# EAGLE design nutrino (EAGLE 9.6.2)
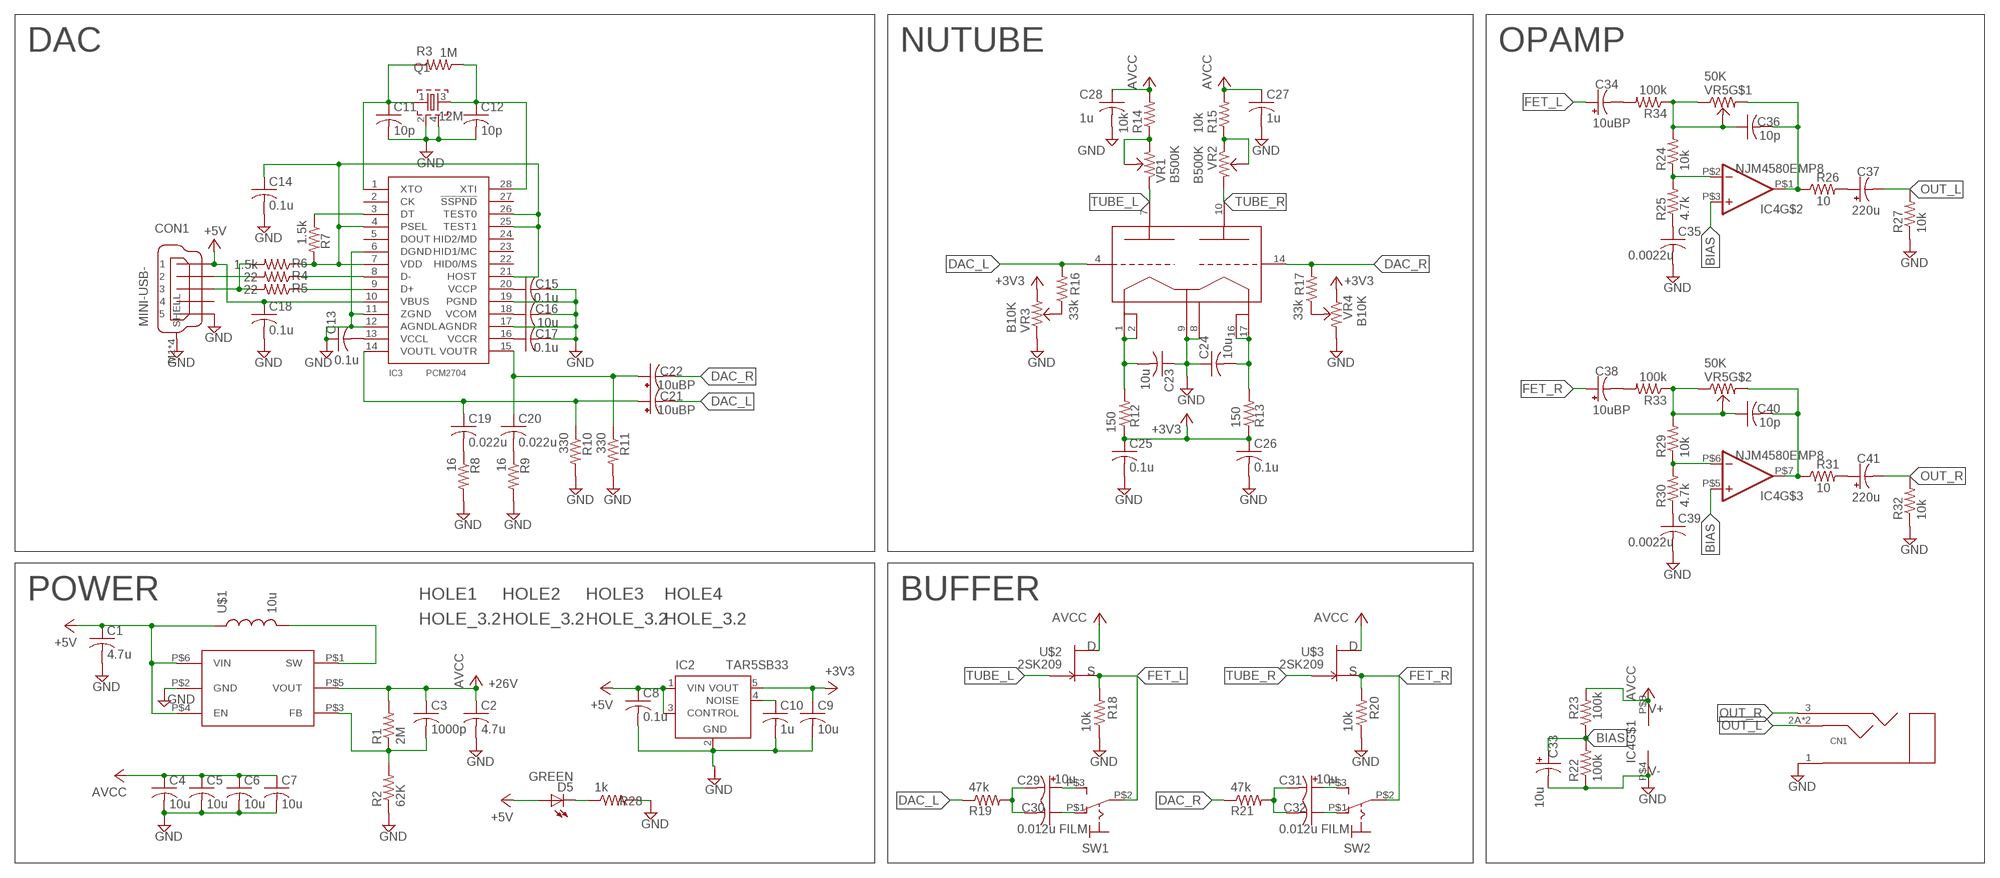
[diagram p0: schematic, sheet 1]

## Parts
C1  4.7u  C-2012  [2012-C]
C2  4.7u  C-2012  [2012-C]
C3  1000p  C-2012  [2012-C]
C4  10u  C-2012  [2012-C]
C5  10u  C-2012  [2012-C]
C6  10u  C-2012  [2012-C]
C7  10u  C-2012  [2012-C]
C8  0.1u  C-2012  [2012-C]
C9  10u  C-2012  [2012-C]
C10  1u  C-2012  [2012-C]
C11  10p  C-2012  [2012-C]
C12  10p  C-2012  [2012-C]
C13  0.1u  C-2012  [2012-C]
C14  0.1u  C-2012  [2012-C]
C15  0.1u  C-2012  [2012-C]
C16  10u  C-3216  [3216]
C17  0.1u  C-2012  [2012-C]
C18  0.1u  C-2012  [2012-C]
C19  0.022u  C-2012  [2012-C]
C20  0.022u  C-2012  [2012-C]
C21  10uBP  CC-2.5-7  [E2,5-7]
C22  10uBP  CC-2.5-7  [E2,5-7]
C23  10u  C-3216  [3216]
C24  10u  C-3216  [3216]
C25  0.1u  C-2012  [2012-C]
C26  0.1u  C-2012  [2012-C]
C27  1u  C-2012  [2012-C]
C28  1u  C-2012  [2012-C]
C29  10u  CC-2.5-7  [E2,5-7]
C30  0.012u FILM  C/5  [C050-024X044]
C31  10u  CC-2.5-7  [E2,5-7]
C32  0.012u FILM  C/5  [C050-024X044]
C33  10u  CC-2.5-7  [E2,5-7]
C34  10uBP  CC-2.5-7  [E2,5-7]
C35  0.0022u  C-2012  [2012-C]
C36  10p  C-2012  [2012-C]
C37  220u  CC-2.5-7  [E2,5-7]
C38  10uBP  CC-2.5-7  [E2,5-7]
C39  0.0022u  C-2012  [2012-C]
C40  10p  C-2012  [2012-C]
C41  220u  CC-2.5-7  [E2,5-7]
CN1  STEREO-3.5-MJ8435  [MJ8435]
CON1  MINI-USB-  [UX60A-MB-5ST]
D5  GREEN  LED-SMD2012  [D2012]
HOLE1  HOLE_3.2  [HOLE_3.2]
HOLE2  HOLE_3.2  [HOLE_3.2]
HOLE3  HOLE_3.2  [HOLE_3.2]
HOLE4  HOLE_3.2  [HOLE_3.2]
IC1  TLV61046A  [SOT23-6]
IC2  TAR5SB33  [SSOP5-P-0.95]
IC3  PCM2704  [SSOP28]
IC4  NJM4580EMP8  [EMP8]
Q1  12M  FA-238V  [FA-238V]
R1  2M  R-2012  [2012-R]
R2  62K  R-2012  [2012-R]
R3  1M  R-2012  [2012-R]
R4  22  R-2012  [2012-R]
R5  22  R-2012  [2012-R]
R6  1.5k  R-2012  [2012-R]
R7  1.5k  R-2012  [2012-R]
R8  16  R-2012  [2012-R]
R9  16  R-2012  [2012-R]
R10  330  R-2012  [2012-R]
R11  330  R-2012  [2012-R]
R12  150  R-2012  [2012-R]
R13  150  R-2012  [2012-R]
R14  10k  R-2012  [2012-R]
R15  10k  R-2012  [2012-R]
R16  33k  R-2012  [2012-R]
R17  33k  R-2012  [2012-R]
R18  10k  R-2012  [2012-R]
R19  47k  R-2012  [2012-R]
R20  10k  R-2012  [2012-R]
R21  47k  R-2012  [2012-R]
R22  100k  R-2012  [2012-R]
R23  100k  R-2012  [2012-R]
R24  10k  R-2012  [2012-R]
R25  4.7k  R-2012  [2012-R]
R26  10  R-4532  [4532]
R27  10k  R-2012  [2012-R]
R28  1k  R-2012  [2012-R]
R29  10k  R-2012  [2012-R]
R30  4.7k  R-2012  [2012-R]
R31  10  R-4532  [4532]
R32  10k  R-2012  [2012-R]
R33  100k  R-2012  [2012-R]
R34  100k  R-2012  [2012-R]
SW1  SLIDESW_SS12D01G4  [SS12D01G4]
SW2  SLIDESW_SS12D01G4  [SS12D01G4]
U1  NUTUBE_6P1_1  [NUTUBE_6P1_1]
U$1  10u  INDUCTOR-NR10050T  [NR10050T]
U$2  2SK209  [SC59]
U$3  2SK209  [SC59]
VR1  B500K  VR2  [VR2]
VR2  B500K  VR2  [VR2]
VR3  B10K  VR2  [VR2]
VR4  B10K  VR2  [VR2]
VR5  50K  VR2C  [VR2C]

## Nets
+3V3: C9.1 C25.1 C26.1 IC2.5(VOUT) R12.1 R13.1 VR3.2 VR4.1
+5V: C1.1 C8.1 C18.1 CON1.1 D5.A IC1.P$4(EN) IC1.P$6(VIN) IC2.1(VIN) IC2.3(CONTROL) IC3.10(VBUS) U$1.1
AVCC: C2.1 C3.1 C4.1 C5.1 C6.1 C7.1 C27.1 C28.1 IC1.P$5(VOUT) IC4.P$8(V+) R1.2 R14.2 R15.2 R23.2 U$2.E(D) U$3.E(D)
BIAS: C33.+ IC4.P$3(+IN) IC4.P$5(+IN) R22.2 R23.1
DAC_L: C21.- R16.2 R19.1 U1.4(G1_4)
DAC_R: C22.- R17.2 R21.1 U1.14(G2_14)
FET_L: C34.+ R18.2 SW1.P$2(P) U$2.B(S)
FET_R: C38.+ R20.2 SW2.P$2(P) U$3.B(S)
GND: C1.2 C2.2 C4.2 C5.2 C6.2 C7.2 C8.2 C9.2 C10.2 C11.2 C12.2 C13.1 C14.2 C15.2 C16.2 C17.2 C18.2 C23.1 C24.1 C25.2 C26.2 C27.2 C28.2 C33.- C35.2 C39.2 CN1.1(SLEEVE) CON1.5 CON1.M1(SHELL) CON1.M2(SHELL) CON1.M3(SHELL) CON1.M4(SHELL) IC1.P$2(GND) IC2.2(GND) IC3.6(DGND) IC3.11(ZGND) IC3.12(AGNDL) IC3.17(AGNDR) IC3.19(PGND) IC4.P$4(V-) Q1.2 Q1.4 R2.1 R8.2 R9.2 R10.2 R11.2 R18.1 R20.1 R22.1 R27.1 R28.2 R32.1 U1.8(GND_8) U1.9(F2_9) VR3.1 VR4.2
N$1: C11.1 IC3.1(XTO) Q1.1 R3.2
N$2: IC1.P$1(SW) U$1.2
N$3: C12.1 IC3.28(XTI) Q1.3 R3.1
N$4: C3.2 IC1.P$3(FB) R1.1 R2.2
N$5: IC3.9(D+) R5.1
N$6: IC3.8(D-) R4.1
N$7: CON1.2 R4.2
N$8: CON1.3 R5.2 R6.2
N$9: C13.2 IC3.13(VCCL)
N$10: C14.1 IC3.4(PSEL) IC3.7(VDD) IC3.21(HOST) IC3.25(TEST1) IC3.26(TEST0) R6.1 R7.2
N$11: C15.1 IC3.20(VCCP)
N$12: C17.1 IC3.16(VCCR)
N$13: C16.1 IC3.18(VCOM)
N$14: C19.2 R8.1
N$15: IC3.3(DT) R7.1
N$16: C20.2 R9.1
N$17: C20.1 C22.+ IC3.15(VOUTR) R11.1
N$18: C19.1 C21.+ IC3.14(VOUTL) R10.1
N$19: D5.K R28.1
N$20: R14.1 VR1.2 VR1.BR
N$21: C10.1 IC2.4(NOISE)
N$22: C24.2 R13.2 U1.16(F3_16) U1.17(F3_17)
N$23: C23.2 R12.2 U1.1(F1_1) U1.2(F1_2)
N$24: C30.1 SW1.P$1(O)
N$25: C29.+ SW1.P$3(S)
N$26: R15.1 VR2.1 VR2.BR
N$27: R16.1 VR3.BR
N$28: R17.1 VR4.BR
N$29: C32.1 SW2.P$1(O)
N$30: C31.+ SW2.P$3(S)
N$31: C29.- C30.2 R19.2
N$32: IC4.P$2(-IN) R24.1 R25.2
N$33: C35.1 R25.1
N$34: C36.1 R24.2 R34.1 VR5.2(BR) VR5.3
N$35: C34.- R34.2
N$36: C36.2 IC4.P$1(OUT) R26.1 VR5.1
N$37: C31.- C32.2 R21.2
N$38: C37.+ R26.2
N$40: IC4.P$6(-IN) R29.1 R30.2
N$41: C39.1 R30.1
N$42: C40.1 R29.2 R33.1 VR5.2'(BR) VR5.3'
N$43: C38.- R33.2
N$44: C40.2 IC4.P$7(OUT) R31.1 VR5.1'
N$45: C41.+ R31.2
OUT_L: C37.- CN1.2A(RING) CN1.2B(RING) R27.2
OUT_R: C41.- CN1.3(TIP) R32.2
TUBE_L: U1.7(A1_7) U$2.C(G) VR1.1
TUBE_R: U1.10(A2_10) U$3.C(G) VR2.2
Unconnected: CON1.4 IC3.2(CK) IC3.5(DOUT) IC3.22(HID0/MS) IC3.23(HID1/MC) IC3.24(HID2/MD) IC3.27(!SSPND!)

## Notes on the sheet
- DAC | NUTUBE | OPAMP
- POWER | BUFFER
- +26V

## Library data of the parts
C1-C20 C23-C28 C30 C32 C35 C36 C39 C40 = Passive_Robotech:C
C21 C22 C29 C31 C33 C34 C37 C38 C41 = Passive_Robotech:CC
CN1 = Connector_Robotech:STEREO
CON1 = Connector_Robotech:MINI-USB-: MINI USB Connector Source: http://www.hirose.co.jp/cataloge_hp/e24000019.pdf
D5 = Diode_Robotech:LED
HOLE1-HOLE4 = Document_Robotech:HOLE_3.2: Robotech hole diameter 3.2mm tDoc washer(diameter 8mm) bDoc spacer(diameter 6mm)
IC1 = IC_Robotech:TLV61046A
IC2 = IC_Robotech:TAR5SB: Voltage Regulator max 200mA. Pin assignment differs from TAR5S*
IC3 = IC_Robotech:PCM2704
IC4 = IC_Robotech:NJM4580
Q1 = Passive_Robotech:FA-: MHz RANGE CRYSTAL UNIT Source: Epson Toyocom
R1-R34 = Passive_Robotech:R
SW1 SW2 = Passive_Robotech:SLIDESW: Slide Switch
U1 = rezzonics:NUTUBE_6P1: NUTUBE 6P1 Twin Triode Datasheet <http://nutube.us/downloads/Nutube_Datasheet_31.pdf>
U$1 = Passive_Robotech:INDUCTOR: Inductors Basic Inductor/Choke - 0603 and 1206. Footprints are not proven and vary greatly between part numbers.
U$2 U$3 = Transistor_Robotech:2SK209
VR1-VR4 = Passive_Robotech:VR
VR5 = Passive_Robotech:VR2C

## Net classes
0 default: width 0.25 mm, drill 0.5 mm, clearance 0.254 mm
1 PWR: width 0.4 mm, drill 0.5 mm, clearance 0.254 mm

## Board
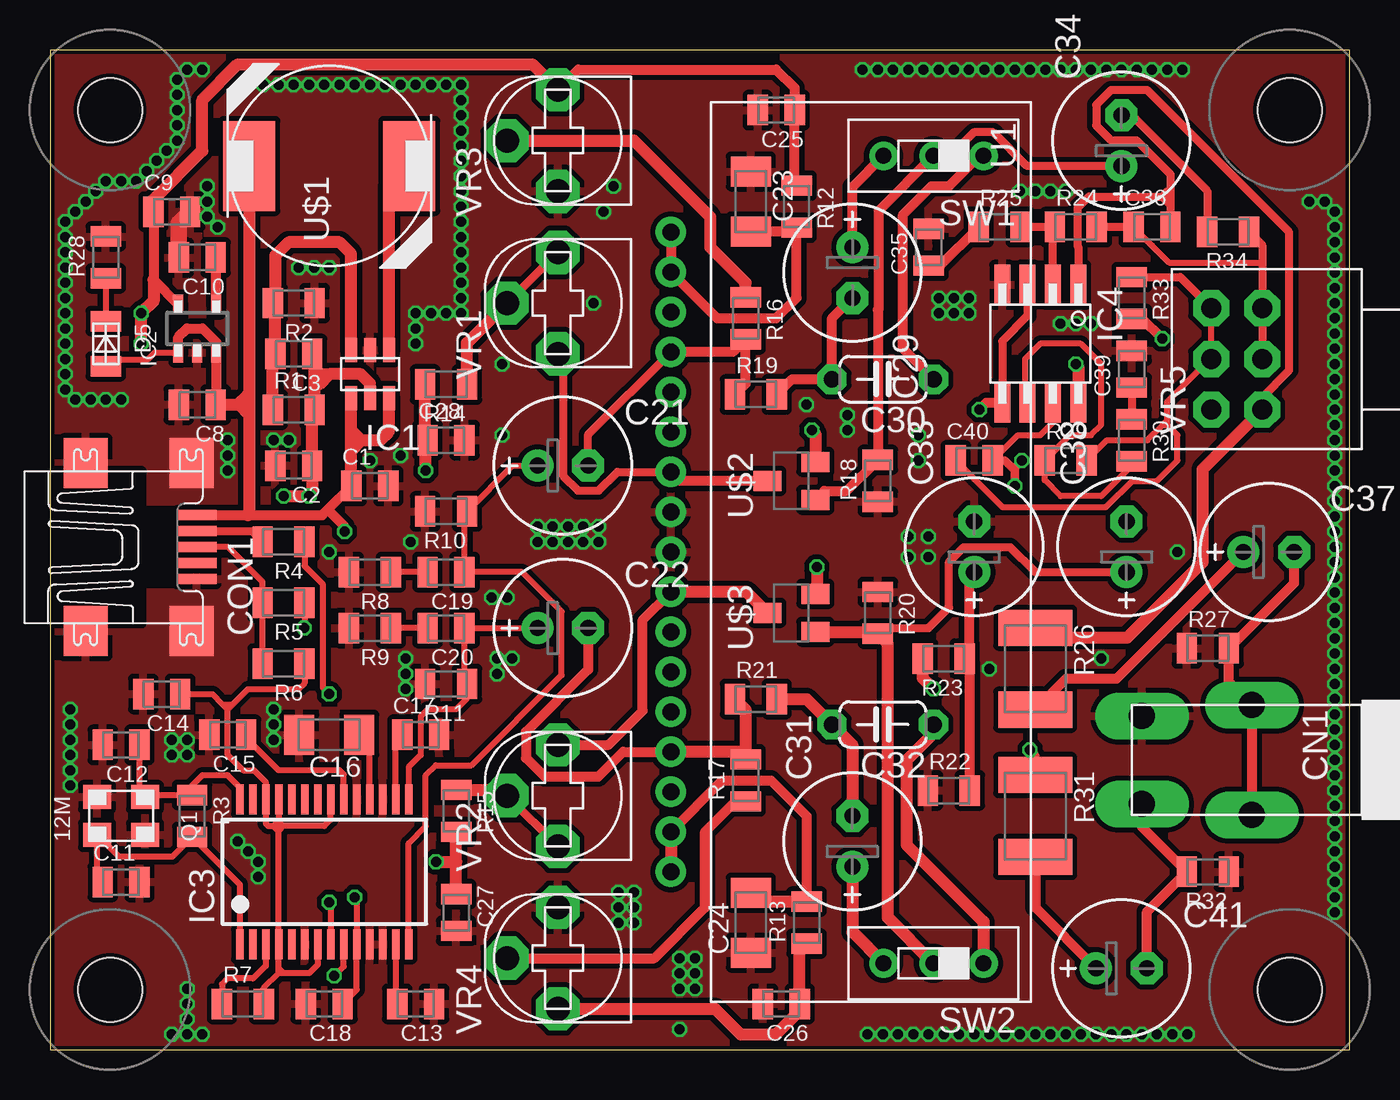
[diagram p1: board, top side]
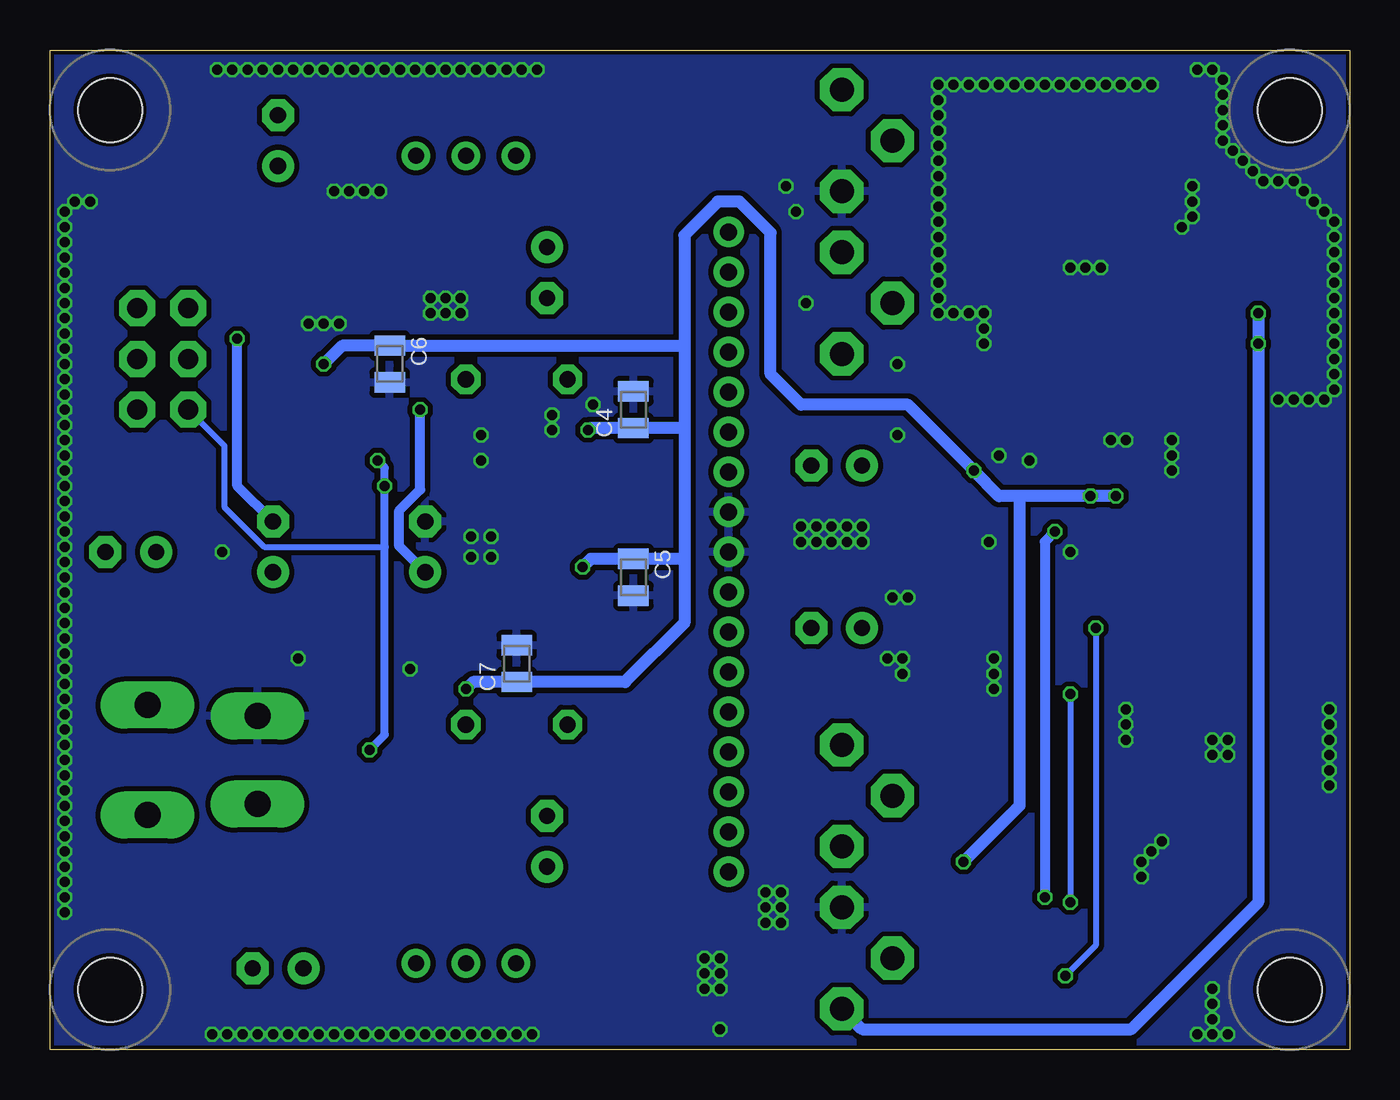
[diagram p2: board, bottom side, seen from below]

Size 65 x 50 mm. Coordinates in mm from the lower left corner, seen from the top.
Outline: 0,0 65,0 65,50 0,50 0,0
Copper layers (1*16): Top 0.035mm / dielectric 1.6mm / Bottom 0.035mm
Design rules "jlcpcb-2layers": minimum track width 5mil, minimum drill 0.3mm, track to track 5mil, track to pad 5mil, pad to pad 5mil, via to via 5mil, smd to smd 0mil, copper to edge 0.2mm, drill to drill 6mil, minimum pad ring 10mil, minimum via ring 3mil, stop-mask expansion 4mil, vias tented up to drill 0.5mm, thermal gap 10mil

### Footprints (pad centres in the part's own frame; a part is rotated, then mirrored left to right if it is on the bottom)
2012-C = smd 1.016 x 1.524: 1 -0.921,0; 2 0.921,0
3216 = smd 1.5 x 2: 1 -1.5,0; 2 1.5,0
E2,5-7 = drill 0.813 pad 1.6: + -1.27,0 | drill 0.813 pad 1.6 octagon: - 1.27,0
C050-024X044 = drill 0.813 octagon: 1 -2.54,0; 2 2.54,0
MJ8435 = drill 1.3 long: 1 -2.2,-5.5; 2A -2.75,0; 2B 2.75,0; 3 2.2,-5.5
UX60A-MB-5ST = smd 2 x 0.5: 1 2.25,1.6; 2 2.25,0.8; 3 2.25,0; 4 2.25,-0.8; 5 2.25,-1.6 | smd 2.2 x 2.5: M1 -3.3,-4.2; M2 -3.3,4.2; M3 2,4.2; M4 2,-4.2
D2012 = smd 1.016 x 1.524: A 1.127,0; K -1.127,0
HOLE_3.2 = hole 3.2: 0,0
SOT23-6 = smd 0.6 x 1.2: P$1 -0.95,-1.2; P$2 0,-1.2; P$3 0.95,-1.2; P$4 0.95,1.2; P$5 0,1.2; P$6 -0.95,1.2
SSOP5-P-0.95 = smd 0.5 x 1: 1 -0.95,-1.2; 2 0,-1.2; 3 0.95,-1.2; 4 0.95,1.2; 5 -0.95,1.2
SSOP28 = smd 0.38 x 1.5: 1 -4.225,-3.625; 2 -3.575,-3.625; 3 -2.925,-3.625; 4 -2.275,-3.625; 5 -1.625,-3.625; 6 -0.975,-3.625; 7 -0.325,-3.625; 8 0.325,-3.625; 9 0.975,-3.625; 10 1.625,-3.625; 11 2.275,-3.625; 12 2.925,-3.625; 13 3.575,-3.625; 14 4.225,-3.625; 15 4.225,3.625; 16 3.575,3.625; 17 2.925,3.625; 18 2.275,3.625; 19 1.625,3.625; 20 0.975,3.625; 21 0.325,3.625; 22 -0.325,3.625; 23 -0.975,3.625; 24 -1.625,3.625; 25 -2.275,3.625; 26 -2.925,3.625; 27 -3.575,3.625; 28 -4.225,3.625
EMP8 = smd 2 x 0.8: P$1 -2.95,1.905; P$2 -2.95,0.635; P$3 -2.95,-0.635; P$4 -2.95,-1.905; P$5 2.95,-1.905; P$6 2.95,-0.635; P$7 2.95,0.635; P$8 2.95,1.905
FA-238V = smd 1.4 x 1.2: 1 -1.2,-0.95; 2 1.2,-0.95; 3 1.2,0.95; 4 -1.2,0.95
2012-R = smd 1.016 x 1.524: 1 -1.048,0; 2 1.048,0
4532 = smd 1.8 x 3.7: 1 -2.05,0; 2 2.05,0
SS12D01G4 = drill 0.8 pad 1.27: P$1 -2.5,0; P$2 0,0; P$3 2.5,0
NUTUBE_6P1_1 = drill 0.85: 1 -16,-4; 2 -14,-4; 3 -12,-4; 4 -10,-4; 5 -8,-4; 6 -6,-4; 7 -4,-4; 8 -2,-4; 9 0,-4; 10 2,-4; 11 4,-4; 12 6,-4; 13 8,-4; 14 10,-4; 15 12,-4; 16 14,-4; 17 16,-4
NR10050T = smd 2.6 x 4.5: 1 -4,0; 2 4,0
SC59 = smd 1 x 1.4: B -0.95,-1.2; C 0,1.2; E 0.95,-1.2
VR2 = drill 1.2 octagon: 1 -2.54,0; 2 2.54,0; BR 0,2.54
VR2C = drill 1 octagon: 1 0,-2.54; 1' 0,0; 2 2.54,-2.54; 2' 2.54,0; 3 5.08,-2.54; 3' 5.08,0

### Placement (x,y rotation side)
C1  16,28.19 0 top
C2  12.19,29.21 180 top
C3  12.19,34.8 180 top
C4  35.81,32 90 bottom
C5  35.81,23.62 270 bottom
C6  48.01,34.29 270 bottom
C7  41.66,19.3 90 bottom
C8  7.37,32.26 180 top
C9  6.1,41.91 0 top
C10  7.37,39.62 180 top
C11  3.56,8.38 0 top
C12  3.56,15.24 180 top
C13  18.29,2.29 180 top
C14  5.59,17.78 180 top
C15  8.89,15.75 180 top
C16  13.97,15.75 180 top
C17  18.54,15.75 0 top
C18  13.72,2.29 180 top
C19  19.81,23.88 180 top
C20  19.81,21.08 180 top
C21  25.65,29.21 0 top
C22  25.65,21.08 0 top
C23  35.05,42.42 270 top
C24  35.05,6.35 90 top
C25  36.32,46.99 180 top
C26  36.58,2.29 180 top
C27  20.32,6.86 270 top
C28  19.81,30.48 0 top
C29  40.13,38.86 270 top
C30  41.66,33.53 180 top
C31  40.13,10.41 90 top
C32  41.66,16.26 180 top
C33  46.23,25.15 90 top
C34  53.59,45.47 90 top
C35  43.94,40.13 90 top
C36  55.12,41.15 0 top
C37  60.96,24.89 0 top
C38  53.85,25.15 90 top
C39  54.1,34.04 90 top
C40  46.23,29.46 0 top
C41  53.59,4.06 0 top
CN1  60.12,14.48 270 top
CON1  5.08,25.13 0 top
D5  2.79,35.31 270 top
HOLE1  3,47 0 top
HOLE2  3,3 0 top
HOLE3  62,3 0 top
HOLE4  62,47 0 top
IC1  16,33.78 180 top
IC2  7.37,36.07 0 top
IC3  13.72,8.89 0 top
IC4  49.53,35.31 270 top
Q1  3.56,11.68 0 top
R1  12.19,32 0 top
R2  12.19,37.34 180 top
R3  7.11,11.68 270 top
R4  11.68,25.4 180 top
R5  11.68,22.35 180 top
R6  11.68,19.3 180 top
R7  9.65,2.29 0 top
R8  16,23.88 180 top
R9  16,21.08 180 top
R10  19.81,26.92 180 top
R11  19.81,18.29 180 top
R12  37.34,42.16 270 top
R13  37.85,6.35 90 top
R14  19.81,33.27 180 top
R15  20.32,11.94 270 top
R16  34.8,36.58 270 top
R17  34.8,13.46 90 top
R18  41.4,28.45 90 top
R19  35.31,32.77 0 top
R20  41.4,21.84 270 top
R21  35.31,17.53 0 top
R22  44.96,12.95 0 top
R23  44.7,19.56 180 top
R24  51.31,41.15 0 top
R25  47.5,41.15 0 top
R26  49.28,19.05 270 top
R27  57.91,20.07 0 top
R28  2.79,39.62 90 top
R29  50.8,29.46 0 top
R30  54.1,30.48 270 top
R31  49.28,11.68 270 top
R32  57.91,8.89 180 top
R33  54.1,37.59 270 top
R34  58.93,40.89 180 top
SW1  44.2,44.7 180 top
SW2  44.2,4.32 180 top
U1  35.05,24.89 270 top
U$1  13.97,44.2 0 top
U$2  37.08,28.45 90 top
U$3  37.08,21.84 90 top
VR1  25.4,37.34 90 top
VR2  25.4,12.7 90 top
VR3  25.4,45.47 90 top
VR4  25.4,4.57 90 top
VR5  58.09,32 90 top

### Tracks (layer width: path | path; a pad name or v marks a point on that pad's centre or on a via)
+3V3  (via drill 0.5 pad 0.75)
  Top 0.508: C9.1 5.17,38.51 IC2.5 | R12.1 37.24,43.31 C25.1 37.24,48.1 36.32,49.02 26.42,49.02 VR3.2
  Top 0.61: C9.1 5.17,42.51 7.62,44.96 7.62,47.5 9.4,49.28 24.13,49.28 VR3.2 | 5.17,38.51 5.17,37.43 v4.57,36.83 v4.57,35.31 | R13.1 37.5,4.95 C26.1 37.5,1.94 36.32,0.76 34.54,0.76 33.27,2.03 VR4.1
  Bottom 0.61: v4.57,36.83 4.57,7.37 10.92,1.02 24.38,1.02 VR4.1
+5V  (via drill 0.5 pad 0.75)
  Top 0.305: C18.1 15.34,2.99 IC3.10 15.34,7.52 v15.24,7.62 | IC2.1 5.24,34.87 4.9,34.52 3.14,34.52 D5.A
  Top 0.508: CON1.1 9.91,26.73 13.62,26.73 13.89,27 | 13.89,27 C1.1 | C8.1 8.32,32.29 IC2.3 8.32,35.39 7.63,36.07 6.86,36.07 6.42,35.63 IC2.1 | 13.89,27 14.73,26.16 v14.73,25.91
  Top 0.61: C1.1 15.05,28.22 15.05,29.97 | 15.05,29.97 15.05,30.48 | 15.05,30.48 15.05,30.99 | 15.05,30.99 IC1.P$4 | 15.05,30.48 15.56,30.48 | 15.56,30.48 16.51,30.48 16.95,30.92 IC1.P$6 | 15.05,30.99 15.56,30.48 | 15.56,30.48 15.05,29.97 | U$1.1 9.97,32.77 | 9.97,32.77 9.97,32.26 | 9.97,32.26 9.97,31.75 | 9.97,31.75 9.97,26.79 9.91,26.73 | 9.97,32.26 9.46,32.26 | C8.1 9.4,32.26 | 9.4,32.26 9.91,32.77 9.97,32.77 | 9.4,32.26 9.46,32.26 | 9.46,32.26 9.97,31.75
  Bottom 0.508: v14.73,25.91 15.24,25.4 v15.24,7.62
AVCC  (via drill 0.5 pad 0.75)
  Top 0.61: 13.24,33.27 R1.2 13.11,31.88 C2.1 13.11,27.84 v12.95,27.69 v11.68,27.69 | 13.24,33.27 13.24,33.78 | 13.24,33.78 13.24,34.67 C3.1 | IC1.P$5 16,33.32 15.54,33.78 13.97,33.78 | 13.24,33.78 13.97,33.78 | 13.97,33.78 13.46,33.27 13.24,33.27 | C27.1 20.32,9.4 | 20.32,9.4 R15.2 | C28.1 18.8,30.57 | R14.2 18.76,30.61 18.8,30.57 | v18.8,28.96 18.8,30.57 | v19.3,9.4 20.32,9.4 | v38.1,30.99 38.28,30.8 U$2.E | v51.31,34.29 51.44,34.16 IC4.P$8 | v44.2,18.03 43.66,18.57 R23.2 | v38.35,24.13 38.35,22.86 U$3.E
  Bottom 0.61: 16.51,27.69 17.53,27.69 v18.8,28.96 22.1,32.26 27.43,32.26 28.96,33.78 28.96,40.86 30.52,42.42 31.59,42.42 33.27,40.73 33.27,35.05 | 16.51,27.69 16.51,12.19 v19.3,9.4 | v11.68,27.69 16.51,27.69 | 33.27,35.05 33.27,30.99 | 33.27,30.99 33.37,31.08 C4.1 38.01,31.08 v38.1,30.99 | 33.27,35.05 33.43,35.21 C6.1 50.39,35.21 v51.31,34.29 | 33.27,30.99 33.27,24.38 | 33.27,24.38 33.27,21.34 36.23,18.38 C7.1 43.85,18.38 v44.2,18.03 | 33.27,24.38 33.43,24.54 C5.1 37.94,24.54 v38.35,24.13
BIAS  (via drill 0.5 pad 0.75)
  Top 0.406: IC4.P$3 48.9,36.7 47.62,35.43 IC4.P$5
  Top 0.508: R22.2 46.01,19.3 R23.1 45.97,19.78 45.97,23.62 C33.+ | v46.48,32 46.83,32.36 IC4.P$5
  Bottom 0.508: v46.48,32 46.48,28.01 47.54,26.96 47.54,25.18 C33.+
DAC_L
  Top 0.406: C21.- 26.92,30.76 U1.4
  Top 0.508: R19.1 34.8,33.31 R16.2 34.16,34.89 U1.4
DAC_R
  Top 0.508: C22.- 26.92,19.01 23.81,15.9 23.81,14.58 24.74,13.65 27.43,13.65 28.67,14.89 U1.14
  Top 0.61: U1.14 34.42,14.89 R17.2 34.8,16.99 R21.1
FET_L
  Top 0.406: C34.+ 48.87,44.2 47.18,45.88 46.21,45.88 45.03,44.7 SW1.P$2
  Top 0.508: SW1.P$2 41.44,41.95 41.44,37.05 41.4,37.01 R18.2 39.85,27.94 38.73,27.94 U$2.B
FET_R
  Top 0.406: R20.2 41.69,21.08 43.94,21.08 44.97,22.11 44.97,24.4 45.71,25.13 48.02,25.13 49.28,23.88 C38.+
  Top 0.61: U$3.B 41.3,20.89 R20.2 41.91,20.29 41.91,6.6 SW2.P$2
GND  (via drill 0.5 pad 0.75)
  Top 0.813: C10.2 6.45,41.34 C9.2
  other vias: 44.45,37.59 44.45,36.83 45.21,37.59 45.21,36.83 43.43,30.73 43.43,29.46 43.94,25.65 43.94,24.64 42.93,24.64 42.93,25.65 20.57,48.26 20.57,47.5 20.57,46.74 20.57,45.97 20.57,45.21 20.57,44.45 20.57,43.69 20.57,42.93 20.57,42.16 20.57,41.4 20.57,40.64 20.57,39.88 20.57,39.12 20.57,38.35 20.57,37.59 20.57,36.83 19.81,36.83 19.05,36.83 18.29,36.83 18.29,36.07 18.29,35.31 17.53,29.72 16,29.46 11.18,30.48 11.94,30.48 8.89,30.48 8.89,29.72 8.89,28.96 3.56,32.51 2.79,32.51 2.03,32.51 1.27,32.51 0.76,33.02 0.76,33.78 0.76,34.54 0.76,35.31 0.76,36.07 0.76,36.83 0.76,37.59 0.76,38.35 0.76,39.12 0.76,39.88 0.76,40.64 0.76,41.4 1.27,41.91 1.78,42.42 2.29,42.93 2.79,43.43 3.56,43.43 4.32,43.43 4.83,43.94 5.33,44.45 5.84,44.96 6.35,45.47 6.35,46.23 6.35,46.99 6.35,47.75 6.35,48.51 6.86,49.02 7.62,49.02 19.81,48.26 19.05,48.26 18.29,48.26 17.53,48.26 16.76,48.26 16,48.26 15.24,48.26 14.48,48.26 13.72,48.26 12.95,48.26 12.19,48.26 11.43,48.26 10.67,48.26 9.91,48.26 1.02,17.02 1.02,16.26 1.02,15.49 1.02,14.73 1.02,13.97 1.02,13.21 6.1,15.49 6.1,14.73 6.86,14.73 6.86,15.49 9.4,10.41 9.91,9.91 10.41,9.4 10.41,8.64 6.86,0.76 7.62,0.76 6.1,0.76 6.86,1.52 6.86,2.29 6.86,3.05 31.5,1.02 31.5,3.05 31.5,3.81 31.5,4.57 32.26,4.57 32.26,3.81 32.26,3.05 28.45,7.87 28.45,7.11 29.21,7.11 29.21,7.87 28.45,6.35 29.21,6.35 40.89,0.76 41.66,0.76 42.42,0.76 43.18,0.76 43.94,0.76 44.7,0.76 45.47,0.76 46.23,0.76 46.99,0.76 47.75,0.76 48.51,0.76 49.28,0.76 50.04,0.76 50.8,0.76 51.56,0.76 52.32,0.76 53.09,0.76 53.85,0.76 54.61,0.76 55.37,0.76 56.13,0.76 56.9,0.76 37.85,32.26 39.88,31.75 39.88,30.99 40.64,49.02 41.4,49.02 42.16,49.02 42.93,49.02 43.69,49.02 44.45,49.02 45.21,49.02 45.97,49.02 46.74,49.02 47.5,49.02 48.26,49.02 49.02,49.02 49.78,49.02 50.55,49.02 51.31,49.02 52.07,49.02 52.83,49.02 53.59,49.02 54.36,49.02 55.12,49.02 55.88,49.02 56.64,49.02 12.45,39.12 13.21,39.12 13.97,39.12 50.55,36.32 51.31,36.32 52.07,36.32 11.18,17.02 11.18,16.26 11.18,15.49 22.61,30.73 22.61,34.29 27.18,37.34 28.19,43.18 27.69,41.91 25.15,25.4 25.91,25.4 26.67,25.4 27.43,25.4 24.38,25.4 24.38,26.16 25.15,26.16 25.91,26.16 26.67,26.16 27.43,26.16 22.1,22.61 22.86,22.61 17.78,19.56 17.78,18.8 17.78,18.03 13.97,24.89 18.03,25.4 22.35,19.56 22.35,18.8 23.11,19.56 7.87,43.18 7.87,42.42 7.87,41.66 8.38,41.15 48.51,42.93 49.28,42.93 50.04,42.93 50.8,42.93 45.97,37.59 45.97,36.83 52.58,19.56 46.99,19.05 64.26,7.62 64.26,8.38 64.26,9.14 64.26,9.91 64.26,10.67 64.26,11.43 64.26,12.19 64.26,12.95 64.26,13.72 64.26,14.48 64.26,15.24 64.26,16 64.26,16.76 64.26,17.53 64.26,18.29 64.26,19.05 64.26,19.81 64.26,20.57 64.26,21.34 64.26,22.1 64.26,22.86 64.26,23.62 64.26,24.38 64.26,25.15 64.26,25.91 64.26,26.67 64.26,27.43 64.26,28.19 64.26,28.96 64.26,29.72 64.26,30.48 64.26,31.24 64.26,32 64.26,32.77 64.26,33.53 64.26,34.29 64.26,35.05 64.26,35.81 64.26,36.58 64.26,37.34 64.26,38.1 64.26,38.86 64.26,39.62 64.26,40.39 64.26,41.15 64.26,41.91 63.75,42.42 62.99,42.42 64.26,6.86 56.39,24.89
  pour Top (isolate 0.203): 0,50 65,50 65,0 0,0
  pour Bottom (isolate 0.203): 0,50 65,50 65,0 0,0
  pour Top (no thermals): 5.59,22.61 5.59,19.3 8.64,19.3 8.64,22.61
  pour Top (no thermals): 5.33,30.99 5.33,27.69 8.89,27.69 8.89,30.99
N$1
  Top 0.305: C11.1 2.36,8.66 Q1.1 3.44,9.65 6.13,9.65 R3.2 9.49,8.26 IC3.1
N$2
  Top 0.61: IC1.P$1 16.95,43.18 U$1.2
N$3
  Top 0.305: C12.1 4.48,12.91 Q1.3 4.85,12.73 R3.1 7.11,13.21 7.62,13.72 8.89,13.72 9.49,13.12 IC3.28
N$4
  Top 0.61: R1.1 11.14,34.67 C3.2 11.27,37.21 | 11.27,37.21 R2.2 | IC1.P$3 15.05,39.81 14.48,40.39 11.94,40.39 11.27,39.72 11.27,37.21
N$5  (via drill 0.5 pad 0.75)
  Top 0.305: R5.1 12.73,21.11 v12.7,21.08 | v14.22,3.68 14.69,4.14 IC3.9
  Bottom 0.305: v12.7,21.08 12.7,5.2 v14.22,3.68
N$6  (via drill 0.5 pad 0.75)
  Top 0.305: R4.1 12.73,24.2 13.65,23.28 13.65,18.1 v13.97,17.78 | v13.97,7.37 14.04,7.29 IC3.8
  Bottom 0.305: v13.97,17.78 v13.97,7.37
N$7
  Top 0.406: CON1.2 10.11,25.93 R4.2
N$8
  Top 0.305: R6.2 R5.2 10.64,23.4 8.91,25.13 CON1.3
N$9
  Top 0.305: IC3.13 17.29,2.36 C13.2
N$10
  Top 0.305: R7.2 10.7,3.08 11.44,3.82 | 11.44,3.82 11.44,4.06 | 11.44,4.06 IC3.4 11.43,10.92 | 11.19,11.18 10.92,11.18 10.79,11.31 IC3.26 10.79,13.38 10.2,13.97 9.65,13.97 8.89,14.73 8.89,17.02 | 11.19,11.18 11.43,11.18 | 11.43,11.18 11.68,11.18 | 11.68,11.18 13.72,11.18 14.04,11.5 IC3.21 | IC3.25 11.44,11.43 | 11.44,11.42 11.44,11.19 11.43,11.18 | 11.43,10.92 11.43,11.18 | 11.68,11.18 11.43,10.92 | 11.68,11.18 11.44,11.42 | 11.44,11.42 11.44,11.43 | 11.44,11.43 11.19,11.18 | 11.19,11.18 11.19,11.16 11.43,10.92 | IC3.7 13.39,4.25 12.96,3.82 11.68,3.82 | 11.68,3.82 11.44,3.82 | 11.68,3.82 11.44,4.06 | R6.1 12.73,18.32 12.45,18.03 9.91,18.03 9.14,17.27 | 8.89,17.02 9.14,17.27 | 8.64,17.27 8.13,17.78 C14.1 | 8.64,17.27 8.89,17.02 | 8.64,17.27 9.14,17.27
N$11
  Top 0.305: IC3.20 14.69,13.76 14.48,13.97 11.43,13.97 9.81,15.59 C15.1
N$12
  Top 0.305: IC3.16 17.29,15.42 C17.1
N$13
  Top 0.305: IC3.18 15.99,15.23 C16.1
N$14
  Top 0.305: C19.2 R8.1
N$15
  Top 0.305: IC3.3 10.79,4.19 10.16,3.56 8.89,3.56 8.6,3.27 R7.1
N$16
  Top 0.305: C20.2 R9.1
N$17
  Top 0.305: IC3.15 17.94,14.13 18.54,14.73 18.54,16.67 18.89,17.02 20.32,17.02 20.86,17.56 R11.1 20.73,18.41 C20.1 C22.+
N$18
  Top 0.305: IC3.14 17.94,10.32 18.8,11.18 18.8,13.72 19.3,14.22 21.08,14.22 25.59,18.73 25.59,21.91 23.62,23.88 C19.1 20.73,26.8 R10.1 23.15,29.21 C21.+
N$19
  Top 0.305: R28.1 D5.K
N$20
  Top 0.406: VR1.BR VR1.2
  Top 0.61: R14.1 20.86,35.34 VR1.BR
N$21
  Top 0.508: IC2.4 8.32,39.59 C10.1
N$22
  Top 0.508: U1.16 33.62,13.46 36.07,13.46 37.85,11.68 R13.2
  Top 0.61: R13.2 35.5,7.4 C24.2 | U1.16 U1.17
N$23
  Top 0.508: U1.1 U1.2 33.37,36.58 36.32,36.58 37.34,37.59 R12.2 37.14,40.92 C23.2
N$24
  Top 0.508: C30.1 42.67,35.05 42.67,41.77 44.08,43.18 44.96,43.18 46.48,44.7 SW1.P$1
N$25
  Top 0.508: C29.+ 40.13,43.14 SW1.P$3
N$26
  Top 0.406: VR2.BR VR2.1
  Top 0.61: R15.1 22.57,12.99 VR2.BR
N$27
  Top 0.61: VR3.BR 29.21,45.47 33.02,41.66 33.02,40.13 34.8,38.35 R16.1
N$28
  Top 0.508: VR4.BR 30.23,4.57 32.77,7.11 32.77,10.89 34.29,12.41 R17.1
N$29
  Top 0.61: C32.1 44.2,15.81 42.84,14.46 42.84,10.24 46.7,6.39 SW2.P$1
N$30
  Top 0.61: C31.+ 40.13,5.88 SW2.P$3
N$31
  Top 0.508: R19.2 37.12,33.53 C30.2 39.12,36.58 C29.-
N$32
  Top 0.406: IC4.P$2 50.16,41.05 R24.1 R25.2
N$33
  Top 0.508: C35.1 44.51,39.21 R25.1
N$34
  Top 0.305: C36.1 55.12,40.22 55.97,39.37 60.63,39.37
  Top 0.406: R34.1 60.63,40.24 60.63,39.37 VR5.3 VR5.2 | C36.1 R24.2
N$35
  Top 0.406: C34.- 54.1,46.74 57.88,42.96 R34.2
N$36
  Top 0.305: 60.67,32.04 VR5.1
  Top 0.406: IC4.P$1 51.44,40.15 51.39,40.2 51.39,42.1 51.96,42.67 55.63,42.67 | VR5.1 60.63,32.62 61.98,33.98 61.98,40.89 54.88,47.99 53.07,47.99 52.34,47.26 52.34,46.22 53.07,45.48 54.34,45.48 56.04,43.78 56.04,42.93 | 56.04,42.93 56.04,42.67 | 56.04,42.67 56.04,42.26 | 56.04,42.26 C36.2 | 56.04,42.67 55.63,42.67 | 55.63,42.67 56.04,42.26 | 55.63,42.67 55.88,42.93 56.04,42.93
  Top 0.61: R26.1 49.78,20.59 53.87,20.59 57.66,24.38 57.66,29.04 60.67,32.04
N$37
  Top 0.61: R21.2 37.85,17.53 C32.2 40.13,15.24 C31.-
N$38
  Top 0.508: C37.+ 53.34,18.54 50.82,18.54 R26.2
N$40
  Top 0.305: R30.2 54.1,29.21 52.58,27.69 50.55,27.69 49.75,28.48 R29.1 51.02,30.73 52.07,30.73 52.58,31.24 52.58,34.29 51.56,35.31 49.53,35.31 48.77,34.54 48.77,32.48 IC4.P$6
N$41
  Top 0.406: C39.1 R30.1
N$42
  Top 0.305: VR5.3' VR5.2' 58.02,34.54 55.88,32.41 55.88,31.46 | R29.2 52.86,30.48 54.9,30.48 55.64,31.22 | 55.64,31.22 55.77,31.35 | 55.77,31.35 55.88,31.46 | C40.1 46.23,28.54 46.23,28.53 47.64,27.13 52.81,27.13 54.13,28.45 55.37,28.45 56.39,29.46 56.39,30.73 55.88,31.24 | 55.77,31.35 55.88,31.24 | 55.88,31.24 55.88,31.46 | 55.88,31.24 55.86,31.22 55.64,31.22
  Top 0.406: R33.1 56.53,38.64 VR5.3'
N$43  (via drill 0.5 pad 0.75)
  Top 0.508: v55.63,35.56 54.64,36.54 R33.2
  Bottom 0.508: C38.- 55.63,28.19 v55.63,35.56
N$44  (via drill 0.5 pad 0.75)
  Top 0.305: C40.2 48.42,30.73 49.53,30.73 50.16,31.37 IC4.P$7
  Top 0.406: R31.1 49.28,14.73 v49.02,14.99 | C40.2 47.75,29.46 48.26,28.96 v48.26,28.19 48.26,29.11 v48.62,29.46
  Bottom 0.305: VR5.1' 56.29,30.2 56.29,27.15 54.28,25.15 48.26,25.15
  Bottom 0.406: v49.02,14.99 48.26,15.75 48.26,25.15 v48.26,28.19 48.26,29.11 v48.62,29.46
N$45
  Top 0.508: R31.2 49.28,7.11 C41.+
OUT_L
  Top 0.508: CN1.2B CN1.2A 58.96,18.39 R27.2 62.23,23.34 C37.-
OUT_R
  Top 0.508: C41.- 54.86,6.89 R32.2 54.62,11.14 CN1.3
TUBE_L
  Top 0.406: VR1.1 25.67,34.53 25.67,28.69 26.4,27.95 27.45,27.95 28.38,28.89 U1.7
  Top 0.508: U$2.C 31.5,28.45 U1.7
TUBE_R
  Top 0.508: VR2.2 27.94,15.24 29.64,16.94 29.64,21.48 U1.10
  Top 0.61: U$3.C 34.84,22.89 U1.10

### Text on the board
bValues: ver1.0 | Nutrino | 2023 Hamataku lab.